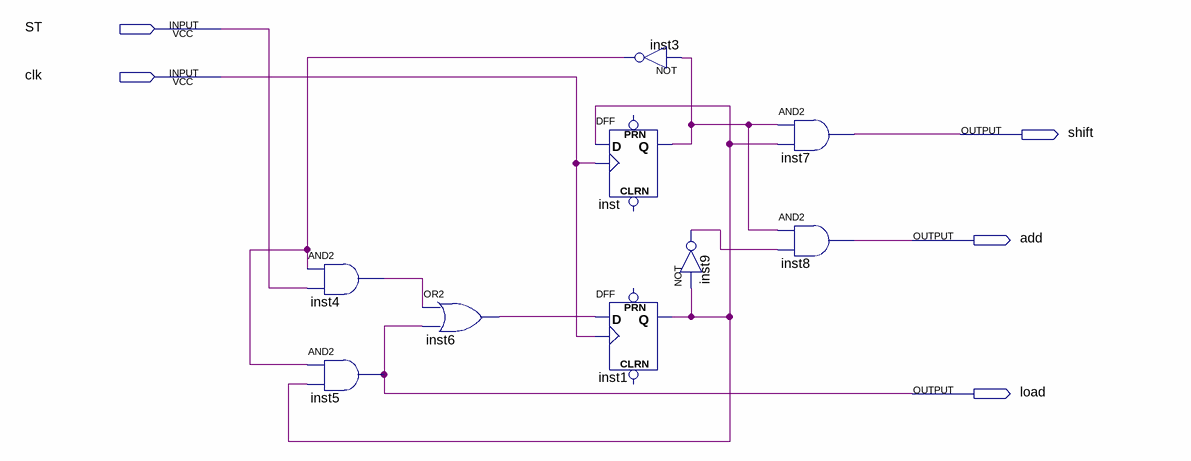
[diagram p0: schematic sheet]
// Quartus schematic state_C.bdf as structural Verilog: 9 symbols, 5 pins
module state_C (
  input  ST,
  input  clk,
  output shift,
  output add,
  output load
);

  wire inst1_q, inst3_out, inst4_out, inst6_out, inst9_out, inst_q;

  and inst4 (inst4_out, inst3_out, ST);
  and inst5 (load, inst3_out, inst1_q);
  or inst6 (inst6_out, inst4_out, load);
  not inst3 (inst3_out, inst_q);
  DFF inst (.CLK(clk), .D(inst1_q), .Q(inst_q));  // open: CLRN, PRN
  DFF inst1 (.CLK(clk), .D(inst6_out), .Q(inst1_q));  // open: CLRN, PRN
  not inst9 (inst9_out, inst1_q);
  and inst7 (shift, inst_q, inst1_q);
  and inst8 (add, inst_q, inst9_out);
endmodule
